# Altium schematic sheet MainSheet.SchDoc
size A4; SheetNumber: 1; SheetTotal: 8
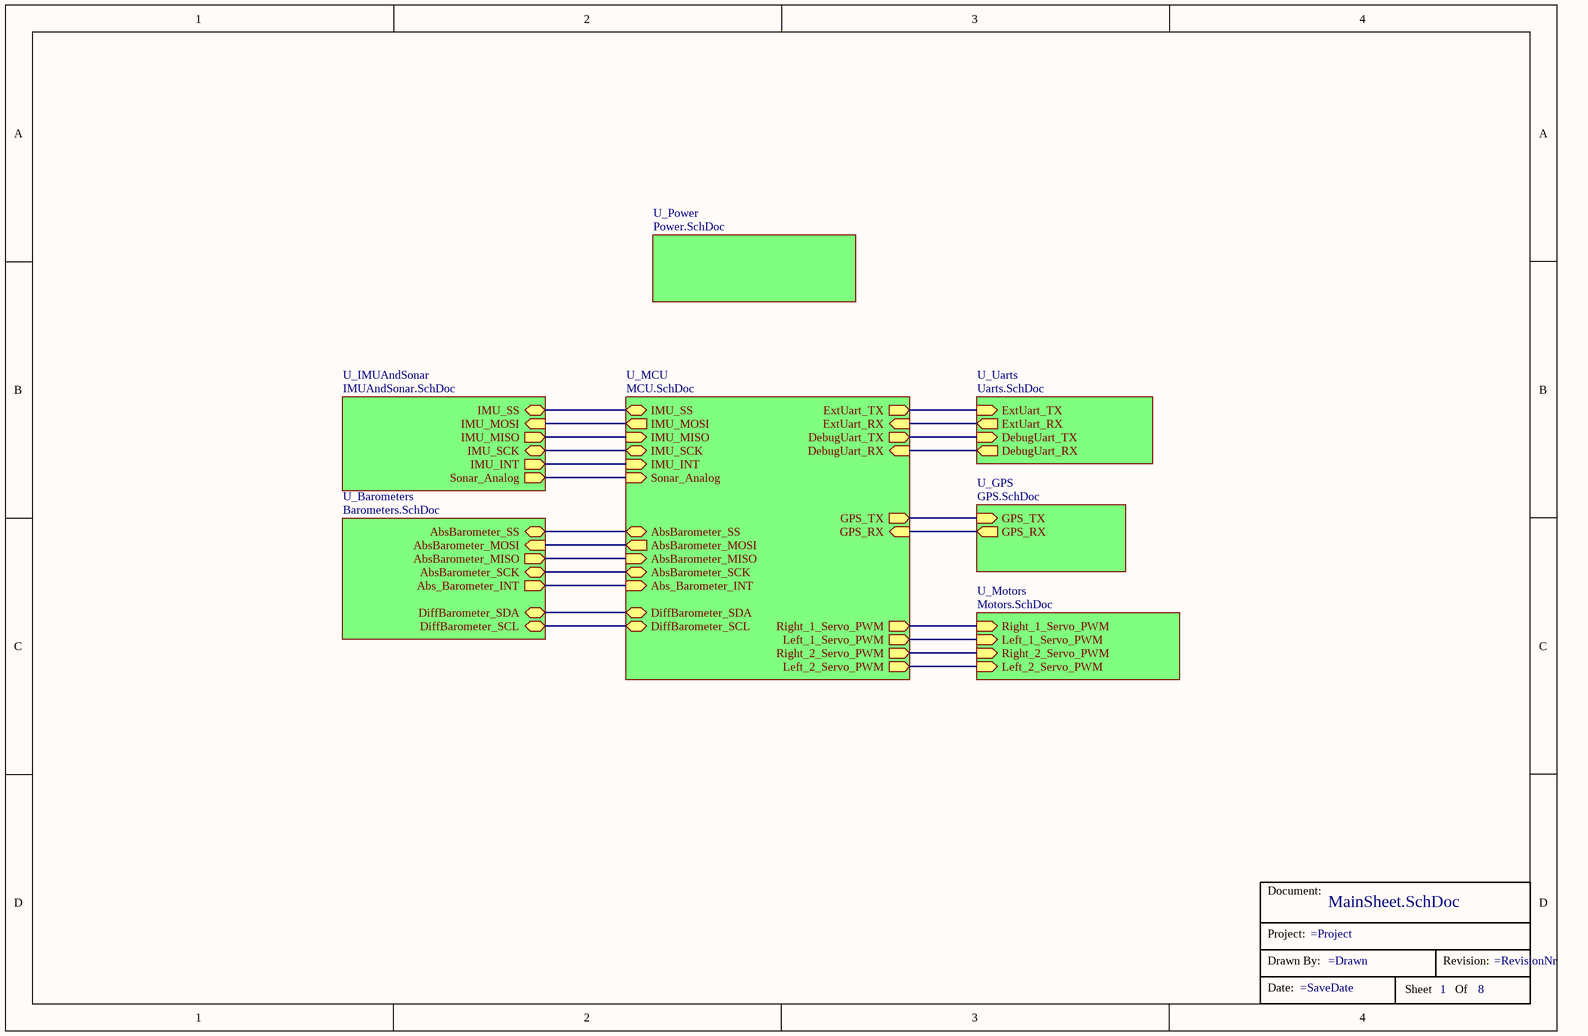
[diagram p0: MainSheet.SchDoc]

## Parts
*  TitleBox  (value not drawn)

## Sub-sheets
U_Barometers = Barometers.SchDoc: AbsBarometer_SCK (bidir), AbsBarometer_MOSI (in), AbsBarometer_MISO (out), AbsBarometer_SS (bidir), DiffBarometer_SCL (bidir), DiffBarometer_SDA (bidir), Abs_Barometer_INT (out)
U_GPS = GPS.SchDoc: GPS_TX (in), GPS_RX (out)
U_IMUAndSonar = IMUAndSonar.SchDoc: IMU_SCK (bidir), IMU_MOSI (in), IMU_MISO (out), IMU_SS (bidir), Sonar_Analog (out), IMU_INT (out)
U_MCU = MCU.SchDoc: ExtUart_RX (in), ExtUart_TX (out), IMU_SS (bidir), IMU_MOSI (out), IMU_MISO (in), IMU_SCK (bidir), GPS_RX (in), GPS_TX (out), DiffBarometer_SDA (bidir), DiffBarometer_SCL (bidir), AbsBarometer_SS (bidir), AbsBarometer_MOSI (out), AbsBarometer_MISO (in), AbsBarometer_SCK (bidir), DebugUart_RX (in), DebugUart_TX (out), Sonar_Analog (in), Right_1_Servo_PWM (out), Left_1_Servo_PWM (out), Right_2_Servo_PWM (out), Left_2_Servo_PWM (out), Abs_Barometer_INT (in), IMU_INT (in)
U_Motors = Motors.SchDoc: Right_1_Servo_PWM (in), Left_1_Servo_PWM (in), Right_2_Servo_PWM (in), Left_2_Servo_PWM (in)
U_Power = Power.SchDoc: no entries
U_Uarts = Uarts.SchDoc: DebugUart_RX (out), DebugUart_TX (in), ExtUart_RX (out), ExtUart_TX (in)

## Nets
(unnamed): sheet U_Uarts/DebugUart_RX, sheet U_MCU/DebugUart_RX
(unnamed): sheet U_Uarts/DebugUart_TX, sheet U_MCU/DebugUart_TX
(unnamed): sheet U_Uarts/ExtUart_RX, sheet U_MCU/ExtUart_RX
(unnamed): sheet U_Uarts/ExtUart_TX, sheet U_MCU/ExtUart_TX
(unnamed): sheet U_GPS/GPS_TX, sheet U_MCU/GPS_TX
(unnamed): sheet U_GPS/GPS_RX, sheet U_MCU/GPS_RX
(unnamed): sheet U_IMUAndSonar/IMU_SCK, sheet U_MCU/IMU_SCK
(unnamed): sheet U_IMUAndSonar/IMU_MOSI, sheet U_MCU/IMU_MOSI
(unnamed): sheet U_IMUAndSonar/IMU_MISO, sheet U_MCU/IMU_MISO
(unnamed): sheet U_IMUAndSonar/IMU_SS, sheet U_MCU/IMU_SS
(unnamed): sheet U_IMUAndSonar/Sonar_Analog, sheet U_MCU/Sonar_Analog
(unnamed): sheet U_IMUAndSonar/IMU_INT, sheet U_MCU/IMU_INT
(unnamed): sheet U_MCU/DiffBarometer_SDA, sheet U_Barometers/DiffBarometer_SDA
(unnamed): sheet U_MCU/DiffBarometer_SCL, sheet U_Barometers/DiffBarometer_SCL
(unnamed): sheet U_MCU/AbsBarometer_SS, sheet U_Barometers/AbsBarometer_SS
(unnamed): sheet U_MCU/AbsBarometer_MOSI, sheet U_Barometers/AbsBarometer_MOSI
(unnamed): sheet U_MCU/AbsBarometer_MISO, sheet U_Barometers/AbsBarometer_MISO
(unnamed): sheet U_MCU/AbsBarometer_SCK, sheet U_Barometers/AbsBarometer_SCK
(unnamed): sheet U_MCU/Right_1_Servo_PWM, sheet U_Motors/Right_1_Servo_PWM
(unnamed): sheet U_MCU/Left_1_Servo_PWM, sheet U_Motors/Left_1_Servo_PWM
(unnamed): sheet U_MCU/Right_2_Servo_PWM, sheet U_Motors/Right_2_Servo_PWM
(unnamed): sheet U_MCU/Left_2_Servo_PWM, sheet U_Motors/Left_2_Servo_PWM
(unnamed): sheet U_MCU/Abs_Barometer_INT, sheet U_Barometers/Abs_Barometer_INT

## Notes on the sheet
- Title
- Size:
- Date:
- A4
- Number:
- Time:
- Revision:
- Sheet
- of
- File:
- (in symbol TitleBox) Document:; Project:; Drawn By:; Revision:; Date:; Sheet; Of